# Altium schematic sheet General.SchDoc
size 431 x 279 mm; SheetNumber: 1; SheetTotal: 6
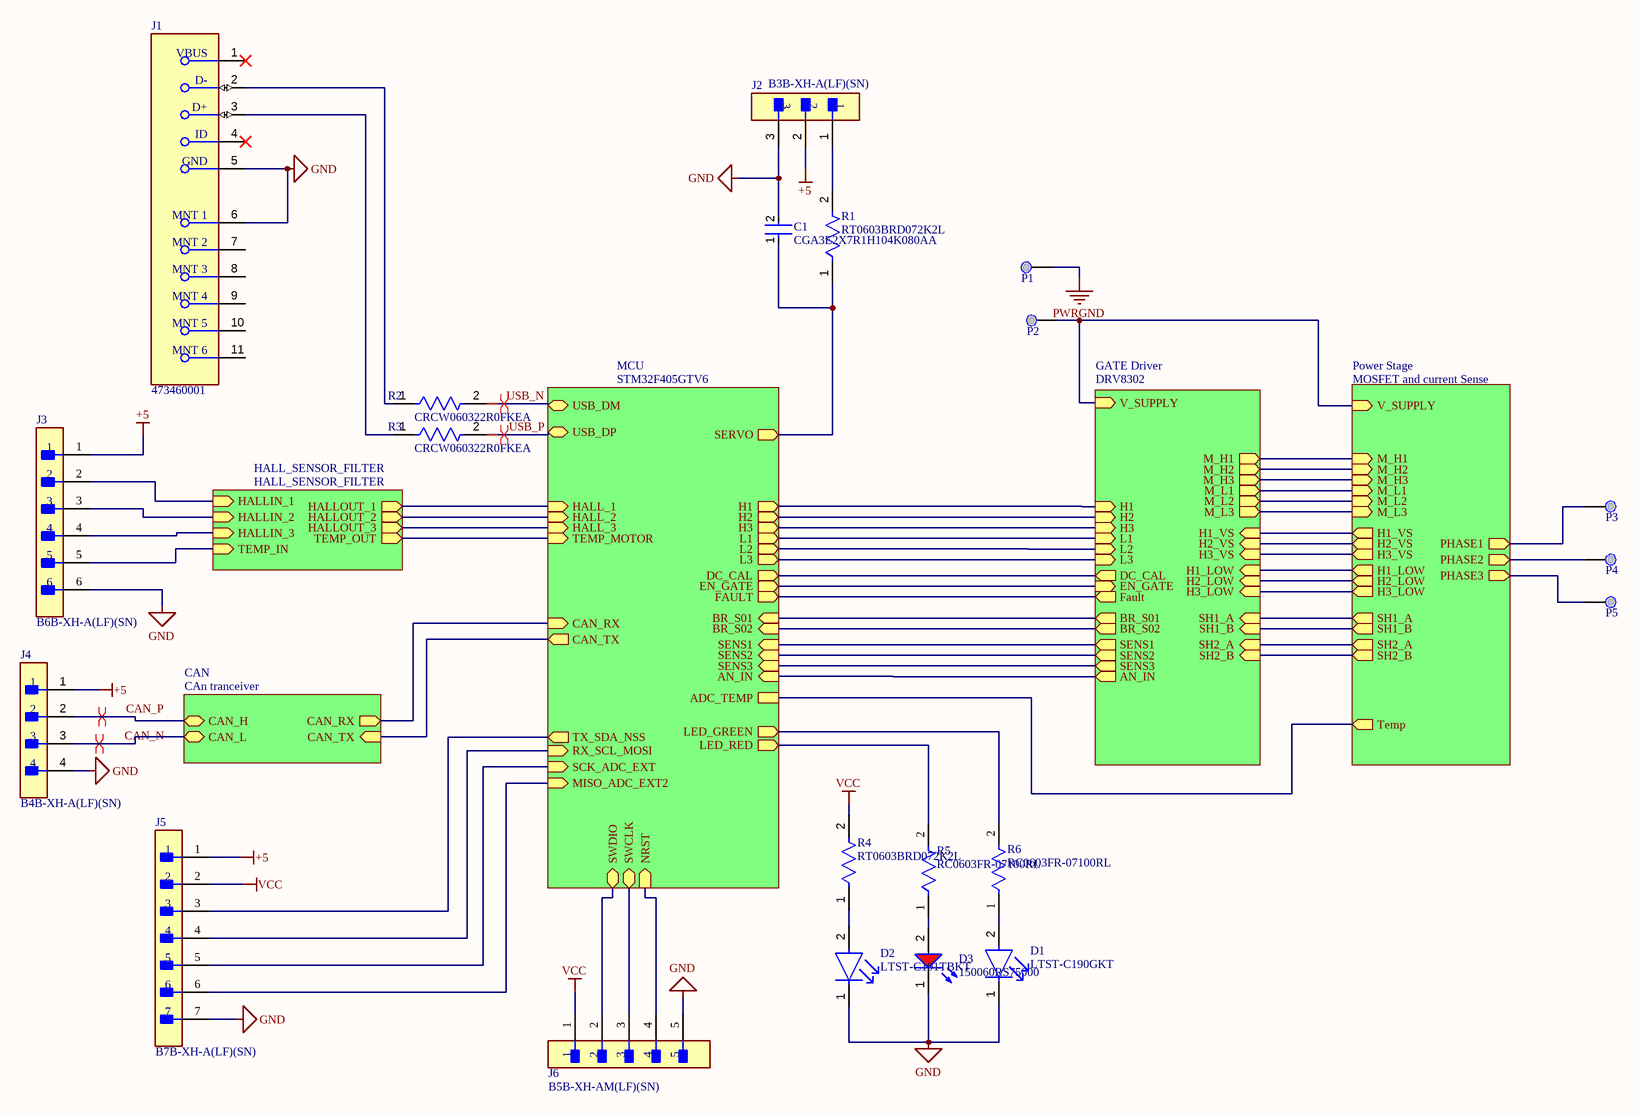
[diagram p0: General.SchDoc]

## Parts
C1  CGA3E2X7R1H104K080AA  [FP-CGA3E-0_3-0_1-IPC_A]
D1  LTST-C190GKT  [FP-LTST-C190GKT-MFG]
D2  LTST-C191TBKT  [FP-LTST-C191TBKT-MFG]
D3  150060RS75000  [WL-SMCW_0603_150060xx75000]
J1  473460001  [FP-473460001-MFG]
J2  B3B-XH-A(LF)(SN)  [FP-B3B-XH-A_LF_SN-MFG]
J3  B6B-XH-A(LF)(SN)  [FP-B6B-XH-A_LF_SN-MFG]
J4  B4B-XH-A(LF)(SN)  [FP-B4B-XH-A_LF_SN-MFG]
J5  B7B-XH-A(LF)(SN)  [FP-B7B-XH-A_LF_SN-MFG]
J6  B5B-XH-AM(LF)(SN)  [FP-B5B-XH-AM_LF_SN-MFG]
P1  Power_Pad  [PowerPad]  (value not drawn)
P2  Power_Pad  [PowerPad]  (value not drawn)
P3  Power_Pad  [PowerPad]  (value not drawn)
P4  Power_Pad  [PowerPad]  (value not drawn)
P5  Power_Pad  [PowerPad]  (value not drawn)
R1  RT0603BRD072K2L  [FP-RT0603-MFG]
R2  CRCW060322R0FKEA  [FP-CRCW0603-e3-IPC_B]
R3  CRCW060322R0FKEA  [FP-CRCW0603-e3-IPC_B]
R4  RT0603BRD072K2L  [FP-RT0603-MFG]
R5  RC0603FR-07100RL  [FP-RC0603-0_55-MFG]
R6  RC0603FR-07100RL  [FP-RC0603-0_55-MFG]

## Sub-sheets
CAN = CAn tranceiver: CAN_RX (out), CAN_TX (in), CAN_H (bidir), CAN_L (bidir)
GATE Driver = DRV8302: H1 (in), H2 (in), H3 (in), L1 (in), L2 (in), L3 (in), Fault (out), DC_CAL (out), EN_GATE (in), BR_S01 (out), BR_S02 (out), SENS1 (out), SENS2 (out), SENS3 (out), V_SUPPLY (in), AN_IN (out), SH1_A (in), SH1_B (in), SH2_A (in), SH2_B (in), M_H1 (out), M_H2 (out), M_H3 (out), M_L1 (out), M_L2 (out), M_L3 (out), H1_VS (in), H2_VS (in), H3_VS (in), H1_LOW (in), H2_LOW (in), H3_LOW (in)
HALL_SENSOR_FILTER = HALL_SENSOR_FILTER: HALLIN_1 (in), HALLIN_2 (in), HALLIN_3 (in), TEMP_IN (in), TEMP_OUT (out), HALLOUT_1 (out), HALLOUT_2 (out), HALLOUT_3 (out)
MCU = STM32F405GTV6: HALL_1 (in), HALL_2 (in), HALL_3 (in), TEMP_MOTOR (in), USB_DM (bidir), USB_DP (bidir), CAN_RX (in), CAN_TX (out), H1 (out), H2 (out), H3 (out), L1 (out), L2 (out), L3 (out), DC_CAL (out), EN_GATE (out), FAULT (out), BR_S01 (in), BR_S02 (in), SENS1 (in), SENS2 (in), SENS3 (in), ADC_TEMP, AN_IN (in), LED_GREEN (out), LED_RED (out), TX_SDA_NSS (out), SCK_ADC_EXT (in), MISO_ADC_EXT2 (in), RX_SCL_MOSI (in), SERVO (out), SWDIO (bidir), SWCLK (bidir), NRST (in)
Power Stage = MOSFET and current Sense: V_SUPPLY (in), M_H1 (in), M_H2 (in), M_H3 (in), M_L1 (in), M_L2 (in), M_L3 (in), H1_VS (out), H2_VS (out), H3_VS (out), H1_LOW (out), H2_LOW (out), H3_LOW (out), SH1_A (out), SH1_B (out), SH2_A (out), SH2_B (out), PHASE1 (out), PHASE2 (out), PHASE3 (out), Temp (out)

## Nets
+5: J2.2 J3.1 J4.1 J5.1
GND: C1.2 D1.1(C) D2.1(C) D3.1(K) J1.5(GND) J1.6(MNT_1) J2.3 J3.6 J4.4 J5.7 J6.5
PWRGND: P1.P?(Power)
VCC: J5.2 J6.1 R4.2
CAN_N: J4.3 ; sheet CAN/CAN_L
CAN_P: J4.2 ; sheet CAN/CAN_H
USB_N: R2.2 ; sheet MCU/USB_DM
USB_P: R3.2 ; sheet MCU/USB_DP
NetC1_1: C1.1 R1.1 ; sheet MCU/SERVO
NetD1_2: D1.2(A) R6.1
NetD2_2: D2.2(A) R4.1
NetD3_2: D3.2(A) R5.1
NetJ1_2: J1.2(D-) R2.1
NetJ1_3: J1.3(D+) R3.1
NetJ2_1: J2.1 R1.2
NetJ3_2: J3.2 ; sheet HALL_SENSOR_FILTER/HALLIN_1
NetJ3_3: J3.3 ; sheet HALL_SENSOR_FILTER/HALLIN_2
NetJ3_4: J3.4 ; sheet HALL_SENSOR_FILTER/HALLIN_3
NetJ3_5: J3.5 ; sheet HALL_SENSOR_FILTER/TEMP_IN
NetJ5_3: J5.3 ; sheet MCU/TX_SDA_NSS
NetJ5_4: J5.4 ; sheet MCU/RX_SCL_MOSI
NetJ5_5: J5.5 ; sheet MCU/SCK_ADC_EXT
NetJ5_6: J5.6 ; sheet MCU/MISO_ADC_EXT2
NetJ6_2: J6.2 ; sheet MCU/SWDIO
NetJ6_3: J6.3 ; sheet MCU/SWCLK
NetJ6_4: J6.4 ; sheet MCU/NRST
NetP2_P?: P2.P?(Power) ; sheet GATE Driver/V_SUPPLY, sheet Power Stage/V_SUPPLY
NetP3_P?: P3.P?(Power) ; sheet Power Stage/PHASE1
NetP4_P?: P4.P?(Power) ; sheet Power Stage/PHASE2
NetP5_P?: P5.P?(Power) ; sheet Power Stage/PHASE3
NetR5_2: R5.2 ; sheet MCU/LED_RED
NetR6_2: R6.2 ; sheet MCU/LED_GREEN
(unnamed): sheet MCU/HALL_1, sheet HALL_SENSOR_FILTER/HALLOUT_1
(unnamed): sheet MCU/HALL_2, sheet HALL_SENSOR_FILTER/HALLOUT_2
(unnamed): sheet MCU/HALL_3, sheet HALL_SENSOR_FILTER/HALLOUT_3
(unnamed): sheet MCU/TEMP_MOTOR, sheet HALL_SENSOR_FILTER/TEMP_OUT
(unnamed): sheet MCU/CAN_RX, sheet CAN/CAN_RX
(unnamed): sheet MCU/CAN_TX, sheet CAN/CAN_TX
(unnamed): sheet MCU/H1, sheet GATE Driver/H1
(unnamed): sheet MCU/H2, sheet GATE Driver/H2
(unnamed): sheet MCU/H3, sheet GATE Driver/H3
(unnamed): sheet MCU/L1, sheet GATE Driver/L1
(unnamed): sheet MCU/L2, sheet GATE Driver/L2
(unnamed): sheet MCU/L3, sheet GATE Driver/L3
(unnamed): sheet MCU/DC_CAL, sheet GATE Driver/DC_CAL
(unnamed): sheet MCU/EN_GATE, sheet GATE Driver/EN_GATE
(unnamed): sheet MCU/FAULT, sheet GATE Driver/Fault
(unnamed): sheet MCU/BR_S01, sheet GATE Driver/BR_S01
(unnamed): sheet MCU/BR_S02, sheet GATE Driver/BR_S02
(unnamed): sheet MCU/SENS1, sheet GATE Driver/SENS1
(unnamed): sheet MCU/SENS2, sheet GATE Driver/SENS2
(unnamed): sheet MCU/SENS3, sheet GATE Driver/SENS3
(unnamed): sheet MCU/ADC_TEMP, sheet Power Stage/Temp
(unnamed): sheet MCU/AN_IN, sheet GATE Driver/AN_IN
(unnamed): sheet GATE Driver/SH1_A, sheet Power Stage/SH1_A
(unnamed): sheet GATE Driver/SH1_B, sheet Power Stage/SH1_B
(unnamed): sheet GATE Driver/SH2_A, sheet Power Stage/SH2_A
(unnamed): sheet GATE Driver/SH2_B, sheet Power Stage/SH2_B
(unnamed): sheet GATE Driver/M_H1, sheet Power Stage/M_H1
(unnamed): sheet GATE Driver/M_H2, sheet Power Stage/M_H2
(unnamed): sheet GATE Driver/M_H3, sheet Power Stage/M_H3
(unnamed): sheet GATE Driver/M_L1, sheet Power Stage/M_L1
(unnamed): sheet GATE Driver/M_L2, sheet Power Stage/M_L2
(unnamed): sheet GATE Driver/M_L3, sheet Power Stage/M_L3
(unnamed): sheet GATE Driver/H1_VS, sheet Power Stage/H1_VS
(unnamed): sheet GATE Driver/H2_VS, sheet Power Stage/H2_VS
(unnamed): sheet GATE Driver/H3_VS, sheet Power Stage/H3_VS
(unnamed): sheet GATE Driver/H1_LOW, sheet Power Stage/H1_LOW
(unnamed): sheet GATE Driver/H2_LOW, sheet Power Stage/H2_LOW
(unnamed): sheet GATE Driver/H3_LOW, sheet Power Stage/H3_LOW

Not connected (* = marked no-connect by the designer): J1 1(VBUS)* 4(ID)* 7(MNT_2) 8(MNT_3) 9(MNT_4) 10(MNT_5) 11(MNT_6)

## Layout directives
differential pair: CAN_N, CAN_P, USB_N, USB_P

## Notes on the sheet
- DWG. NO.
- REV.
- SHT.
- THIS DOCUMENT AND THE DATA DISCLOSED HEREIN OR HEREWITH IS THE PROPERTY OF ALTIUM LIMITED AND MAY BE FREELY DISTRIBUTED IN WHOLE. NO RIGHTS ARE RESERVED OR EXPRESS OR IMPLIED WARANTEE GIVEN.
- REVISION
- DESCRIPTION
- DATE
- APPROVED
- ENG:
- APPROVALS
- PROJECT
- DSN:
- CHK:
- REFERENCE DOCUMENTS
- PROJECT REVISION:
- TITLE
- DOCUMENT REVISION:
- DESIGN ITEM:
- BOM:
- FAB DWG:
- PCB DWG:
- ASSY DWG:
- SCALE:
- SIZE
- B
- CAGE CODE
- FILE NAME
- DWG NO.
- SHEET
- OF
- REV

## Library data of the parts
C1 = CMP-2000-07546-2: Cap Ceramic 100nF 50V X7R 10% Pad SMD 0603 +125°C Automotive T/R; Weight: 7.1E-05oz; Composition: Ceramic; Max Operating Temperature: 125°C; Termination: SMD/SMT; Dielectric: X7R; Length: 1.6mm; Package Quantity: 1; REACH SVHC: No SVHC; Lead Free: Lead Free; Case Code (Metric): 1608; Min Operating Temperature: -55°C; Packaging: Tape and Reel; Tolerance: 10%; Voltage Rating: 50V; Case Code (Imperial): 0603; Capacitance: 100nF; Case/Package: 0603; Voltage Rating (DC): 50V; Depth: 0.8mm; Radiation Hardening: No; Ratings: AEC-Q200; Mount: Surface Mount; Voltage: 50V; Thickness: 0.035inch; Width: 0.8mm; Height: 0.8mm
D1 = CMP-22017-000005-2: LED GREEN CLEAR CHIP SMD; Dominant Wavelength: 569nm; Reverse Voltage: 5V; Lens Color: Colorless; Viewing Angle: 130°; Voltage: 2V; Forward Current: 30mA; Power Dissipation: 100mW; Luminous Intensity: 6mcd; Number of LEDs: 1; Forward Voltage: 2.1V; Wavelength: 565nm; Test Current: 10mA; Min Operating Temperature: -55°C; Lens Style: Clear; Mount: Surface Mount; Width: 0.8mm; Packaging: Tape and Reel; Lens Transparency: Clear; Case Code (Metric): 1608; Depth: 0.8mm; Case Code (Imperial): 0603; Case/Package: 0603; Number of Pins: 2; Max Operating Temperature: 85°C; Lead Free: Lead Free; Number of Elements: 1; Length: 1.6mm; Height: 0.8mm; Package Quantity: 1; Power Rating: 100mW; Radiation Hardening: No; Illumination Color: Green; Color: Green
D2 = CMP-22017-000008-1: LED BLUE CLEAR CHIP SMD; Lens Color: Colorless; Dominant Wavelength: 475nm; Forward Current: 20mA; Wavelength: 468nm; Viewing Angle: 130°; Power Dissipation: 76mW; Luminous Intensity: 180mcd; Reverse Voltage: 5V; Number of Elements: 1; Lens Style: Diffused; Forward Voltage: 3.8V; Max Power Dissipation: 75mW; Case Code (Metric): 1608; Packaging: Tape and Reel; Case/Package: 0603; Depth: 1.6mm; Mount: Surface Mount; Lead Free: Lead Free; Min Operating Temperature: -20°C; Lens Transparency: Clear; Illumination Color: Blue; Height: 0.55mm; Test Current: 20mA; Case Code (Imperial): 0603; Max Operating Temperature: 80°C; Number of Pins: 2; Length: 0.8mm; Radiation Hardening: No; Package Quantity: 1; Number of LEDs: 1; Width: 0.8mm; Color: Blue
D3 = CMP-1426-00001-3: NexarPartId: 29717776; Color: Red; Power Dissipation: 72mW; Max Reverse Voltage (DC): 5V; Peak Wavelength: 630nm; Viewing Angle: 140°; Forward Voltage: 2V; Luminous Intensity: 250mcd; Forward Current: 100mA; Dominant Wavelength: 625nm; Lens Style: Clear, Rectangular; Max Junction Temperature (Tj): 95°C; Test Current: 20mA; Mount: Surface Mount; Packaging: Tape and Reel; Case Code (Metric): 1608; Max Operating Temperature: 85°C; Case Code (Imperial): 0603; REACH SVHC: Unknown; Width: 800µm; Length: 1.6mm; Reverse Voltage: 5V; Height: 700µm; Case/Package: 0603; RoHS: Compliant; Wavelength: 625nm; Min Operating Temperature: -40°C
J1 = CMP-2000-05246-2: CONN RCPT USB2.0 MICRO B SMD R/A; Manufacturer: Molex; Conn Orientation: Right Angle; Is Female: yes; Shielding: true; Pitch: 0.65mm; Number Of Contacts: 5; Voltage Rating: 30V; Current Rating: 1.8A; Device Class L2: USB Connectors; Digikey Description: CONN RCPT USB2.0 MICRO B SMD R/A; Height: 2.945mm; RoHS: TRUE; ComponentLink2Description: Datasheet; Octopart: https://octopart.com/47346-0001-molex-7164928; Automotive: No; Package: 0; Category: Conn; Device Class L1: Connectors; Usb Standard: USB 2.0; Temperature: -30°C to +85°C; Temperature Range Low: -30°C; Footprint Url: https://www.molex.com/pdm_docs/sd/473460001_sd.pdf; ComponentLink2URL: https://www.molex.com/webdocs/datasheets/pdf/en-us/0473460001_IO_CONNECTORS.pdf; Lead Free: Yes; Manufacturer Part Number: 473460001; Contact Material: Gold,Nickel; Temperature Range High: +85°C; Device Class L3: unset
J2 = CMP-17439-000014-3: CONN HEADER VERT 3POS 2.5MM; Max Voltage Rating (DC): 250V; Number of Positions: 3; Current Rating: 3A; Gender: Male; Wire/Cable Gauge: 22AWG; Contact Resistance: 20mR; Insulation Resistance: 1GR; Insulation Material: Nylon; Contact Plating: Tin; Depth: 5.75mm; Contact Type: Male Pin; Max Operating Temperature: 85°C; Insulation Color: Natural; Voltage Rating (AC): 250V; Color: Natural; Connector Type: Header; Orientation: Straight; Fastening Type: Detent; Housing Color: White; Min Operating Temperature: -25°C; Termination: Solder; Voltage Rating: 250V; Series: XH; Pitch: 2.5mm; Contact Shape: Square; Number of Rows: 1; Lead Free: Lead Free; Packaging: Bulk; Mount: Through Hole; Flammability Rating: UL94 V-0; Max Voltage Rating (AC): 250V; REACH SVHC: No SVHC; Housing Material: Polyamide; Contact Material: Brass; Lead Pitch: 2.5mm; Contact Finish - Mating: TIN; Length: 9.9mm; Max Current Rating: 3A; Number of Contacts: 3
J3 = CMP-17439-000076-1: CONN HEADER VERT 6POS 2.5MM
J4 = CMP-17439-000250-1: CONN HEADER VERT 4POS 2.5MM; Number of Contacts: 4; Contact Resistance: 20mR; Voltage Rating: 250V; Max Current Rating: 3A; Gender: Male; Wire/Cable Gauge: 22AWG; Mated Stacking Heights: 9.8mm; Insulation Resistance: 1GR; Orientation: Straight; Contact Type: Male Pin; Contact Finish - Mating: TIN; Series: XH; Max Voltage Rating (AC): 250V; Lead Pitch: 2.5mm; Contact Shape: Square; Insulation Color: Natural; Termination: Solder; Lead Free: Lead Free; Voltage Rating (AC): 250V; Number of Rows: 1; Flammability Rating: UL94 V-0; Number of Positions: 4; Max Operating Temperature: 85°C; Package Quantity: 500; Mount: Through Hole; REACH SVHC: No SVHC; Connector Type: Header; Insulation Material: Nylon; Fastening Type: Detent; Min Operating Temperature: -25°C; Housing Color: White; Packaging: Bulk; Contact Plating: Tin; Contact Material: Brass; Max Voltage Rating (DC): 250V; Housing Material: Polyamide; Color: Natural; Material: Polyamide; Pitch: 2.5mm; Depth: 5.75mm; Current Rating: 3A; Length: 12.4mm
J5 = CMP-17439-000323-2: CONN HEADER VERT 7POS 2.5MM; Current Rating: 3A; Voltage Rating: 250V; Number of Contacts: 7; Mated Stacking Heights: 9.8mm; Insulation Resistance: 1GR; Contact Resistance: 20mR; Wire/Cable Gauge: 22AWG; Contact Finish - Mating: TIN; Orientation: Straight; REACH SVHC: No SVHC; Max Operating Temperature: 85°C; Housing Color: White; Pitch: 2.5mm; Mount: Through Hole; Packaging: Bulk; Depth: 5.75mm; Series: XH; Min Operating Temperature: -25°C; Length: 19.9mm; Connector Type: Header; Number of Positions: 7; Color: Natural; Max Current Rating: 3A; Lead Pitch: 2.5mm; Termination: Solder; Fastening Type: Detent; Flammability Rating: UL94 V-0; Voltage Rating (AC): 250V; Lead Free: Lead Free; Contact Material: Brass; Max Voltage Rating (AC): 250V; Contact Type: Male Pin; Housing Material: Polyamide; Insulation Color: Natural; Contact Shape: Square; Number of Rows: 1; Contact Plating: Tin; Insulation Material: Nylon
J6 = CMP-17439-000304-1: CONN HEADER VERT 5POS 2.5MM; Mated Stacking Heights: 9.8mm; Voltage Rating: 250V; Max Current Rating: 3A; Number of Positions: 5; Contact Resistance: 20mR; Depth: 5.75mm; Connector Type: Header; Color: Green; Insulation Material: Nylon; Contact Plating: Copper; Length: 14.9mm; Fastening Type: Detent; Contact Material: Brass; Number of Rows: 1; Contact Type: Male Pin; Housing Material: Polyamide; Housing Color: White; Lead Free: Lead Free; Max Voltage Rating (AC): 250V; Mount: Through Hole; Contact Shape: Square; Min Operating Temperature: -25°C; Packaging: Bulk; Orientation: Straight; Insulation Color: Natural; Series: XH; Flammability Rating: UL94 V-0; Contact Finish - Mating: TIN; Max Operating Temperature: 85°C; Termination: Solder; Pitch: 2.5mm
R1 R4 = CMP-2000-04423-2: RES 2.20K OHM 1/10W .1% SMD 0603; Manufacturer: Yageo; Power Rating: 0.1W; Tolerance: 0.001; Value: 2.2KΩ; Voltage Rating: 75V; Temperature Coefficient: 25 ppm/°C; Series: RT; Manufacturer Part Number: RT0603BRD072K2L; ComponentLink2URL: http://www.yageo.com/documents/recent/PYu-RT_1-to-0.01_RoHS_L_9.pdf; Octopart: https://octopart.com/rt0603brd072k2l-yageo-1186019; Digikey Description: RES 2.20K OHM 1/10W .1% SMD 0603; Device Class L1: Passive Components; Temperature: -55°C to +155°C; ComponentLink2Description: Datasheet; Mouser Description: High Precision-High Stability Chip Resistor Thin Film 0603 2.2kOhm 0.1% Paper T/R; RoHS: TRUE; Footprint Url: http://www.yageo.com/exep/pages/download/literatures/PYu-R_Mount_10.pdf; Height: 0.55mm; Device Class L2: Resistors; Temperature Range Low: -55°C; Ipc Land Pattern Name: RESC16080X45; Composition: Thin Film; Lead Free: Yes; Temperature Range High: +155°C; Category: Res; Automotive: No; Resistance: 2.2KΩ; Package: RT0603; Device Class L3: Chip SMD Resistors
R2 R3 = CMP-2000-03097-2: RES Thick Film, 22Ω, 1%, 0.1W, 100ppm/°C, 0603; Voltage Rating: 75V; Power Rating: 100mW; Resistance: 22R; Lead Free: Lead Free; Height: 0.45mm; Package Quantity: 5000; Weight: 7.1E-05oz; Width: 0.85mm; Length: 1.55mm; Mount: Surface Mount; Packaging: Tape and Reel; Termination: SMD/SMT; Temperature Coefficient: 100ppm/°C; Case/Package: 0603; Case Code (Metric): 1608; Radiation Hardening: No; Max Operating Temperature: 155°C; Military Standard: Not; Min Operating Temperature: -55°C; Case Code (Imperial): 0603; Contact Plating: Tin; Voltage Rating (DC): 75V; Tolerance: 1%; Depth: 0.85mm; Composition: Thick Film
R5 R6 = CMP-2100-03663-2: NexarPartId: 55402879; Voltage Rating: 50V; Power Rating: 100mW; Tolerance: 1%; Temperature Coefficient: 100ppm/°C; Resistance: 100Ω; Case/Package: 0603; Military Standard: Not; REACH SVHC: Unknown; Case Code (Metric): 0603; Max Operating Temperature: 155°C; Schedule B: 8533210045, 8533210045; Height: 450µm; Length: 1.6mm; Lead Free: Lead Free; Packaging: Tape & Reel; Case Code (Imperial): 0603; Composition: Thick Film; Min Operating Temperature: -55°C; Voltage Rating (DC): 50V; RoHS: Compliant; Depth: 800µm; Number of Pins: 2; Termination: SMD/SMT; Width: 800µm